# Altium schematic sheet Touchcsreen PCB.SchDoc
size A; SheetNumber: 1; SheetTotal: 2
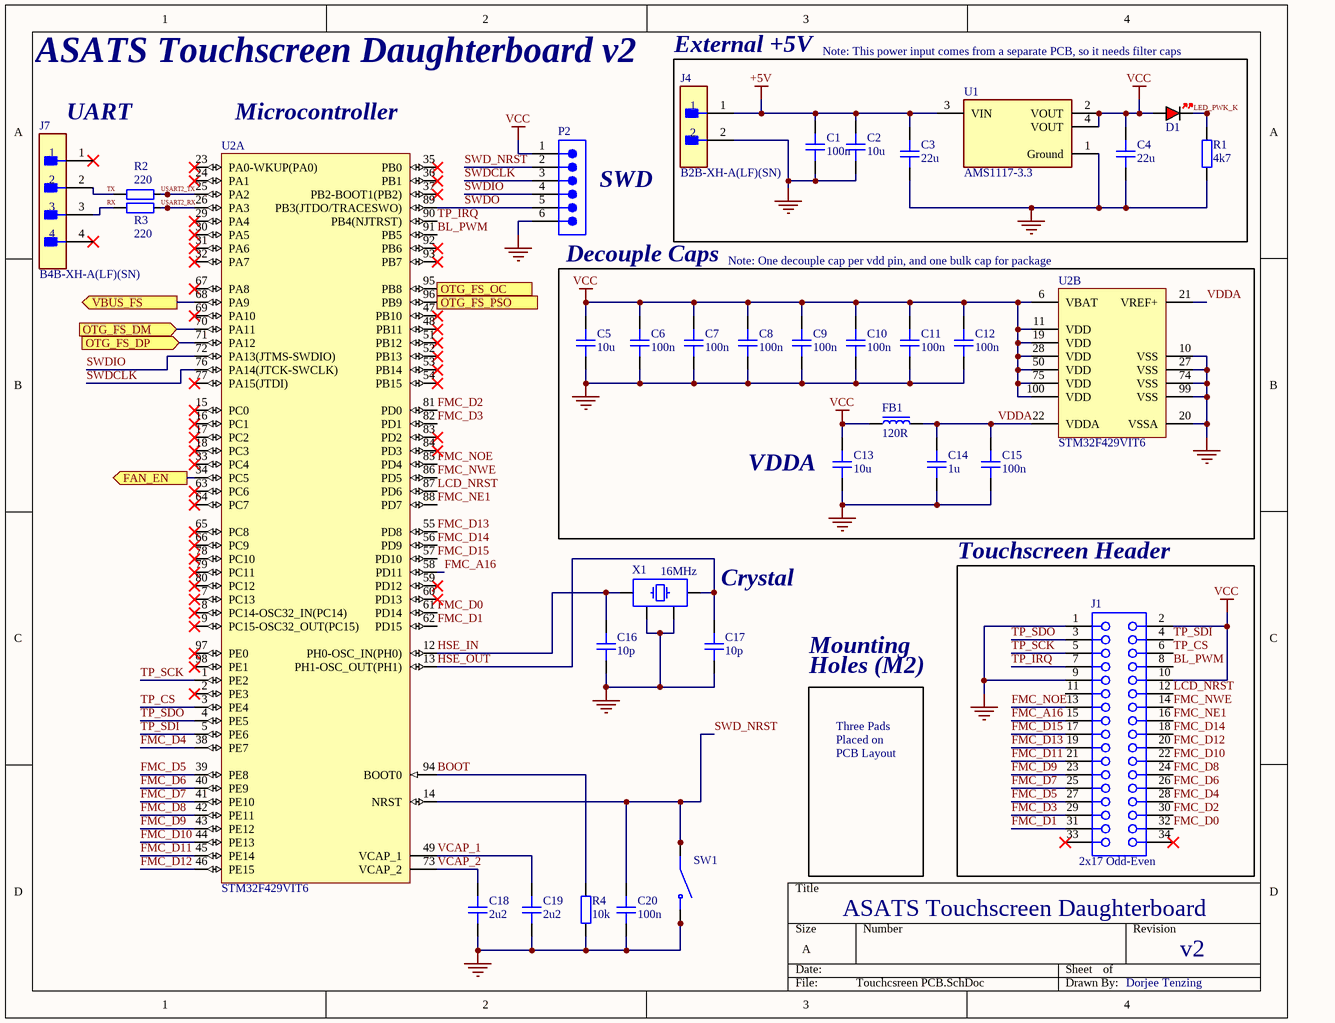
[diagram p0: Touchcsreen PCB.SchDoc]

## Parts
C1  100n  [CAP_0402]
C2  10u  [CAP_0603]
C3  22u  [CAP_0805]
C4  22u  [CAP_0805]
C5  10u  [CAP_0603]
C6  100n  [CAP_0402]
C7  100n  [CAP_0402]
C8  100n  [CAP_0402]
C9  100n  [CAP_0402]
C10  100n  [CAP_0402]
C11  100n  [CAP_0402]
C12  100n  [CAP_0402]
C13  10u  [CAP_0603]
C14  1u  [CAP_0402]
C15  100n  [CAP_0402]
C16  10p  [CAP_0402]
C17  10p  [CAP_0402]
C18  2u2  [CAP_0603]
C19  2u2  [CAP_0603]
C20  100n  [CAP_0402]
D1  RED  [LED_0603_RED]  (value not drawn)
FB1  120R  [FB_0603]
J1  2x17 Odd-Even  [SMTC-SSW-117-01-X-D]
J4  B2B-XH-A(LF)(SN)  [FP-B2B-XH-A_LF_SN-MFG]
J7  B4B-XH-A(LF)(SN)  [FP-B4B-XH-A_LF_SN-MFG]
P2  (no value)  [61300611121]
R1  4k7  [RES_0402]
R2  220  [RES_0402]
R3  220  [RES_0402]
R4  10k  [RES_0402]
SW1  (no value)  [SW_TS-1187A-B-A-B]
U1  AMS1117-3.3  [FP-AMS1117-IPC_C]
U2  STM32F429VIT6  [STM-LQFP100_N]  (parts A,B of 2)
X1  16MHz  [XTAL_3225]

## Blocks framed on the sheet
External +5V: C1-C4 D1 J4 R1 U1
Touchscreen Header: J1

## Ports
FAN_EN (out), OTG_FS_DM (in), OTG_FS_DP (in), OTG_FS_OC (in), OTG_FS_PSO (out), VBUS_FS (out)

## Nets
+5V: C1.2 C2.2 C3.2 J4.1 U1.3(VIN)
GND: C1.1 C2.1 C3.1 C4.1 C5.1 C6.1 C7.1 C8.1 C9.1 C10.1 C11.1 C12.1 C13.1 C14.2 C15.1 C16.1 C17.1 C18.1 C19.1 C20.1 J1.1 J1.9 J4.2 P2.6 R1.1 R4.1 SW1.C(NO) SW1.D(NO) U1.1(Ground) U2.10(VSS) U2.20(VSSA) U2.27(VSS) U2.74(VSS) U2.99(VSS) X1.2 X1.4
VCC: C4.2 C5.2 C6.2 C7.2 C8.2 C9.2 C10.2 C11.2 C12.2 C13.2 D1.A FB1.1 J1.2 J1.10 P2.1 U1.2(VOUT) U1.4(VOUT) U2.6(VBAT) U2.11(VDD) U2.19(VDD) U2.28(VDD) U2.50(VDD) U2.75(VDD) U2.100(VDD)
BL_PWM: J1.8 U2.91(PB5)
BOOT: R4.2 U2.94(BOOT0)
FAN_EN: U2.34(PC5) ; port FAN_EN
FMC_A16: J1.15 U2.58(PD11)
FMC_D0: J1.32 U2.61(PD14)
FMC_D1: J1.31 U2.62(PD15)
FMC_D2: J1.30 U2.81(PD0)
FMC_D3: J1.29 U2.82(PD1)
FMC_D4: J1.28 U2.38(PE7)
FMC_D5: J1.27 U2.39(PE8)
FMC_D6: J1.26 U2.40(PE9)
FMC_D7: J1.25 U2.41(PE10)
FMC_D8: J1.24 U2.42(PE11)
FMC_D9: J1.23 U2.43(PE12)
FMC_D10: J1.22 U2.44(PE13)
FMC_D11: J1.21 U2.45(PE14)
FMC_D12: J1.20 U2.46(PE15)
FMC_D13: J1.19 U2.55(PD8)
FMC_D14: J1.18 U2.56(PD9)
FMC_D15: J1.17 U2.57(PD10)
FMC_NE1: J1.16 U2.88(PD7)
FMC_NOE: J1.13 U2.85(PD4)
FMC_NWE: J1.14 U2.86(PD5)
HSE_IN: C16.2 U2.12(PH0-OSC_IN(PH0)) X1.1
HSE_OUT: C17.2 U2.13(PH1-OSC_OUT(PH1)) X1.3
LCD_NRST: J1.12 U2.87(PD6)
LED_PWK_K: D1.K R1.2
OTG_FS_DM: U2.70(PA11) ; port OTG_FS_DM
OTG_FS_DP: U2.71(PA12) ; port OTG_FS_DP
OTG_FS_OC: U2.95(PB8) ; port OTG_FS_OC
OTG_FS_PSO: U2.96(PB9) ; port OTG_FS_PSO
RX: J7.3 R3.1
SWD_NRST: C20.2 P2.2 SW1.A(COM) SW1.B(COM) U2.14(NRST)
SWDCLK: P2.3 U2.76(PA14(JTCK-SWCLK))
SWDIO: P2.4 U2.72(PA13(JTMS-SWDIO))
SWDO: P2.5 U2.89(PB3(JTDO/TRACESWO))
TP_CS: J1.6 U2.3(PE4)
TP_IRQ: J1.7 U2.90(PB4(NJTRST))
TP_SCK: J1.5 U2.1(PE2)
TP_SDI: J1.4 U2.5(PE6)
TP_SDO: J1.3 U2.4(PE5)
TX: J7.2 R2.1
USART2_RX: R3.2 U2.26(PA3)
USART2_TX: R2.2 U2.25(PA2)
VBUS_FS: U2.68(PA9) ; port VBUS_FS
VCAP_1: C19.2 U2.49(VCAP_1)
VCAP_2: C18.2 U2.73(VCAP_2)
VDDA: C14.1 C15.2 FB1.2 U2.21(VREF+) U2.22(VDDA)

Not connected (* = marked no-connect by the designer): J1 11 33* 34*; J7 1* 4*; U2 2(PE3)* 7(PC13)* 8(PC14-OSC32_IN(PC14))* 9(PC15-OSC32_OUT(PC15))* 15(PC0)* 16(PC1)* 17(PC2)* 18(PC3)* 23(PA0-WKUP(PA0))* 24(PA1)* 29(PA4)* 30(PA5)* 31(PA6)* 32(PA7)* 33(PC4)* 35(PB0)* 36(PB1)* 37(PB2-BOOT1(PB2))* 47(PB10)* 48(PB11)* 51(PB12)* 52(PB13)* 53(PB14)* 54(PB15)* 59(PD12)* 60(PD13)* 63(PC6)* 64(PC7)* 65(PC8)* 66(PC9)* 67(PA8)* 69(PA10)* 77(PA15(JTDI))* 78(PC10)* 79(PC11)* 80(PC12)* 83(PD2)* 84(PD3)* 92(PB6)* 93(PB7)* 97(PE0)* 98(PE1)*

## Notes on the sheet
- ASATS Touchscreen Daughterboard v2
- Note: This power input comes from a separate PCB, so it needs filter caps
- (near J7) UART
- (near U2) Microcontroller
- (near P2) SWD
- (near P2) Decouple Caps
- (near U2) Note: One decouple cap per vdd pin, and one bulk cap for package
- (near C13) VDDA
- Crystal
- Mounting
- Holes (M2)
- Three Pads
- Placed on
- PCB Layout
- ASATS Touchscreen Daughterboard
- v2
- Dorjee Tenzing

## Library data of the parts
C1 C6-C12 C15 C20 = CAP_0402: Capacitor SMD 0402; Manufacturer: Samsung Electro-Mechanics; Manufacturer Part Number: CL05B104KO5NNNC; Rating: 16V; Distributor Link: *; LCSC: C1525; Dielectric: *
C2 C5 C13 = CAP_0603: Capacitor SMD 0603; Manufacturer: *Samsung Electro-Mechanics; Manufacturer Part Number: CL10A106MA8NRNC; Rating: 25V; Distributor Link: *; LCSC: C96446; Dielectric: *
C3 C4 = CAP_0805: Capacitor SMD 0805; Manufacturer: Samsung Electro-Mechanics; Manufacturer Part Number: CL21A226MAQNNNE; Rating: 25V; Distributor Link: *; LCSC: C45783; Dielectric: *
C14 = CAP_0402: Capacitor SMD 0402; Manufacturer: Samsung Electro-Mechanics; Manufacturer Part Number: CL05A105KA5NQNC; Rating: 25V; Distributor Link: *; LCSC: C52923; Dielectric: *
C16 C17 = CAP_0402: Capacitor SMD 0402; Manufacturer: Samsung Electro-Mechanics; Manufacturer Part Number: CL05C100JB5NNNC; Rating: 50V; LCSC: C32949; Dielectric: *
C18 C19 = CAP_0603: Capacitor SMD 0603; Manufacturer: Samsung Electro-Mechanics; Manufacturer Part Number: CL10A225KO8NNNC; Rating: 16V; Distributor Link: *; LCSC: C23630; Dielectric: *
D1 = LED_0603_RED: LED 0603 RED SMD; Manufacturer: Hubei KENTO Elec; Manufacturer Part Number: KT-0603R; LCSC: C2286
FB1 = FB_0603: Ferrite Bead SMD 0603; Manufacturer: Murata Electronics; Manufacturer Part Number: BLM18PG121SN1D; Distributor Link: *; LCSC: C14709
J1 = CMP-1023-00453-1: SQ Post Socket, Through-hole, Vertical, -55 to 105 degC, 2.54 mm Pitch, 34-Pin, Female, RoHS; PartNumber: SSW-117-01-T-D; Manufacturer: Samtec; Pitch: 2.54 mm; NotOnBOM: Yes; RoHS: True; ComponentLink3URL: http://www.samtec.com/documents/webfiles/cpdf/SSW-1XX-XX-XXX-X-XX-XXX-XX-MKT.pdf; ComponentLink2Description: Datasheet; Orientation: Vertical; DatasheetVersion: F-214; ComponentLink1Description: Manufacturer URL; ComponentLink3Description: Package Specification; Mounting Technology: Through-hole; Temperature Range: -55 to 105 degC; PackageReference: SSW-117-01-X-D; ComponentLink1URL: http://www.samtec.com; PackageDescription: Assembly, Socket Strip .016 X .031 Tail; PackageVersion: CA, 6/1987; ComponentLink2URL: http://www.samtec.com/documents/webfiles/pdf/SSW_TH.PDF
J4 = CMP-2000-05888-3: CONN HEADER VERT 2POS 2.5MM; Current Rating: 3A; Voltage Rating: 250V; Number of Contacts: 2; Contact Resistance: 20mR; Wire/Cable Gauge: 22AWG; Insulation Resistance: 1GR; Connector Type: Male Pin; Packaging: Bulk; Contact Material: Brass; Lead Free: Lead Free; Orientation: Straight; Contact Plating: Tin; Max Current Rating: 3A; Termination: Solder; Fastening Type: Detent; Depth: 5.75mm; Housing Material: Polyamide; REACH SVHC: No SVHC; Series: XH; Voltage Rating (AC): 250V; Number of Positions: 2; Color: Natural; Contact Type: Male Pin; Max Voltage Rating (DC): 250V; Pitch: 2.5mm; Lead Pitch: 2.5mm; Mount: Through Hole; Max Operating Temperature: 85°C; Length: 7.4mm; Max Voltage Rating (AC): 250V; Min Operating Temperature: -25°C; Number of Rows: 1; Housing Color: White
J7 = CMP-17439-000250-1: CONN HEADER VERT 4POS 2.5MM; Number of Contacts: 4; Contact Resistance: 20mR; Voltage Rating: 250V; Max Current Rating: 3A; Gender: Male; Wire/Cable Gauge: 22AWG; Mated Stacking Heights: 9.8mm; Insulation Resistance: 1GR; Orientation: Straight; Contact Type: Male Pin; Contact Finish - Mating: TIN; Series: XH; Max Voltage Rating (AC): 250V; Lead Pitch: 2.5mm; Contact Shape: Square; Insulation Color: Natural; Termination: Solder; Lead Free: Lead Free; Voltage Rating (AC): 250V; Number of Rows: 1; Flammability Rating: UL94 V-0; Number of Positions: 4; Max Operating Temperature: 85°C; Package Quantity: 500; Mount: Through Hole; REACH SVHC: No SVHC; Connector Type: Header; Insulation Material: Nylon; Fastening Type: Detent; Min Operating Temperature: -25°C; Housing Color: White; Packaging: Bulk; Contact Plating: Tin; Contact Material: Brass; Max Voltage Rating (DC): 250V; Housing Material: Polyamide; Color: Natural; Material: Polyamide; Pitch: 2.5mm; Depth: 5.75mm; Current Rating: 3A; Length: 12.4mm
P2 = CMP-1502-01070-3: NexarPartId: 20084590; Current Rating: 3A; Pitch: 2.54mm; Gender: Male; Operating Supply Voltage: 250V; Connector Type: Male Pin; Number of Positions: 6; Contact Resistance: 20mΩ; NotOnBOM: Yes; Packaging: Bulk; Number of Pins: 6; Number of Rows: 1; Contact Plating: Gold; Lead Free: Lead Free; RoHS: Compliant; Contact Mating Length: 5.9944mm; Voltage Rating: 250V; REACH SVHC: Unknown; Contact Gender: Male; Housing Material: PBT; Min Operating Temperature: -40°C; Lead Pitch: 2.54mm; Mount: Through Hole; Number of Contacts: 6; Max Operating Temperature: 105°C; Contact Material: Copper; Orientation: Vertical; Termination: Through Hole; Color: Black; Height: 8.89mm
R1 = RES_0402: Resistor SMD 0402; Manufacturer: UNI-ROYAL(Uniroyal Elec); Manufacturer Part Number: 0402WGF4701TCE; Distributor Link: *; LCSC: C25900
R2 R3 = RES_0402: Resistor SMD 0402; Manufacturer: UNI-ROYAL(Uniroyal Elec); Manufacturer Part Number: 0402WGF2200TCE; Distributor Link: *; LCSC: C25091
R4 = RES_0402: Resistor SMD 0402; Manufacturer: UNI-ROYAL(Uniroyal Elec); Manufacturer Part Number: 0402WGF1002TCE; Distributor Link: *; LCSC: C25744
SW1 = Push_Button_SW: None Without 50mA 5.1mm 100000 Times 160gf 12V 5.1mm 1.5mm Round Button Standing paste SPST SMD Tactile Switches ROHS; Manufacturer: XKB Connection; Manufacturer Part Number: TS-1187A-B-A-B; LCSC: C318884
U1 = CMP-209535-000001-1: LDO Voltage Regulators 1A, 3.3V; Manufacturer: Advanced Monolithic Systems; Dropout Voltage: 1.1V; Output Type: Fixed; Nominal Supply Current: 5mA; Max Power Dissipation: 1.2W; Max Supply Voltage: 15V; Number Of Outputs: 1; Standoff Height: 0.64mm; Max Junction Temp: +125°C; Height: 1.8mm; Package: AMS1117; Device Class L2: Power Management ICs; ComponentLink2Description: Datasheet; ComponentLink2URL: http://www.advanced-monolithic.com/pdf/ds1117.pdf; Category: IC; RoHS: TRUE; Automotive: No; Device Class L1: Integrated Circuits (ICs); Output Current: 1A; Device Class L3: Voltage Regulators - Linear; Temperature: -40°C to +125°C; Output Voltage: 3.3V; Manufacturer Part Number: AMS1117-3.3; Temperature Range Low: -40°C; Octopart: https://octopart.com/ams1117-3.3-advanced+monolithic+systems-25899300; Lead Free: Yes; Ipc Land Pattern Name: SOT229P700X180-4; Temperature Range High: +125°C; LCSC: C6186
U2 = CMP-0243-00030-2: ARM Cortex-M4 32-bit MCU+FPU, 225 DMIPS, 2048 kB Flash, 256 kB Internal RAM, 82 I/Os, 100-pin LQFP, -40 to 85 degC, Tray; Manufacturer: STMicroelectronics; FLASH Size (Prog) (kB): 2048; Supply Voltage(Vcc) min (V): 1.8; Operating Frequency(F) (Processor speed) (MHz): 180; Supply Voltage(Vcc) max (V): 3.6; D/A Converter: 2x12-bit; Internal RAM Size (kB): 256; I/Os (High Current): 82; Mounting Technology: Surface Mount; ComponentLink3URL: http://www.st.com/st-web-ui/static/active/en/resource/technical/document/data_brief/DM00071938.pdf; ComponentLink2URL: http://www.st.com/st-web-ui/static/active/en/resource/technical/document/data_brief/DM00053488.pdf; ComponentLink3Description: Package Specification; Packing: Tray; PackageDescription: 100-Pin Low Profile Quad Flat Package, 14 x 14 mm Body, 0.5 mm Pitch; PartNumber: STM32F429VIT6; ComponentLink2Description: Datasheet; ComponentLink1Description: Manufacturer URL; ComponentLink1URL: http://www.st.com/web/en/home.html; DatasheetVersion: Rev. 2; Core: ARM Cortex-M4; PackageReference: LQFP100; PackageVersion: Rev. 1, 06/2013; Manufacturer Part Number: STM32F429VIT6; LCSC: C92002
X1 = X3225_16MHZ: Manufacturer: YXC Crystal Oscillators; Manufacturer Part Number: X322516MLB4SI; LCSC: C13738